# EasyEDA Pro project ProPrj_Practice 4 layer_2025-09-09.epro, schematic Schematic1, sheets 1 to 3 of 5

## Sheets
1 Main: Board Name: Main; Create Date: 2025-08-18; Page Name: Main; Project Name: Practice 4 layer; Schematic Name: Schematic1; Update Date: 2025-09-06; Company: EasyEDA.com; Page Size: A4; Version: V1.0
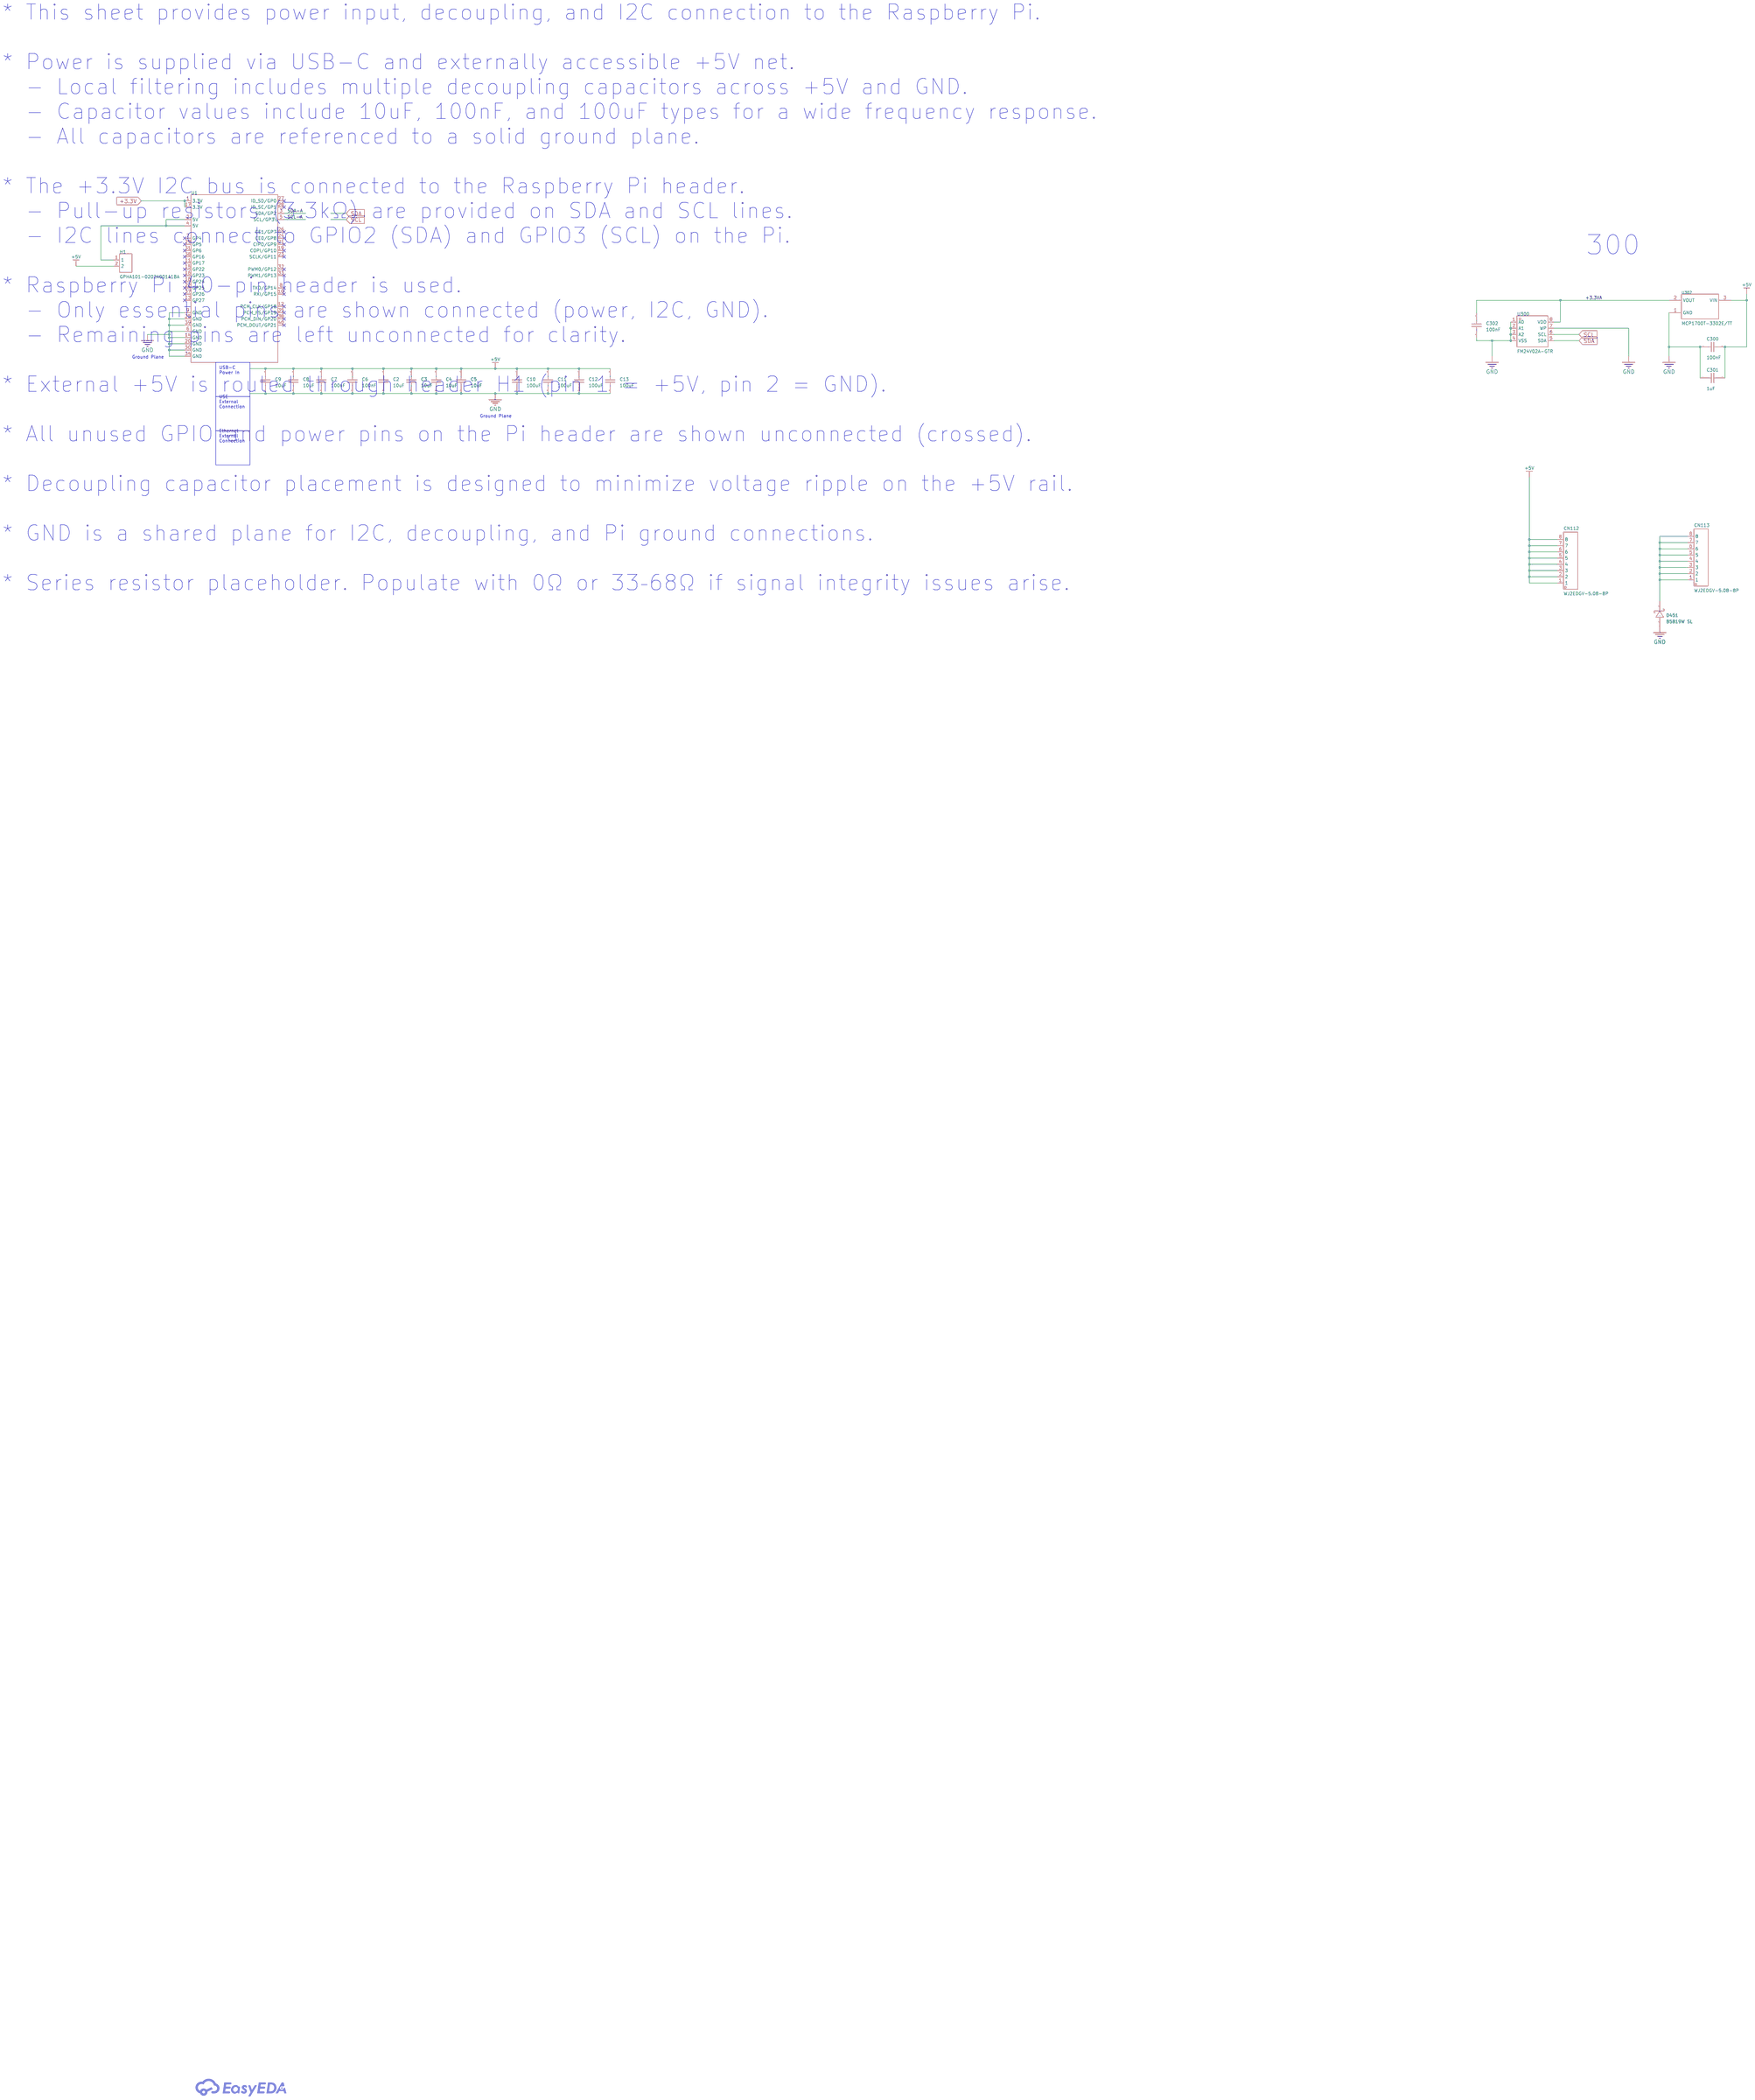
[diagram p10: Main]
2 Analog Out: Create Date: 2025-08-27; Page Name: Analog Out; Update Date: 2025-09-05
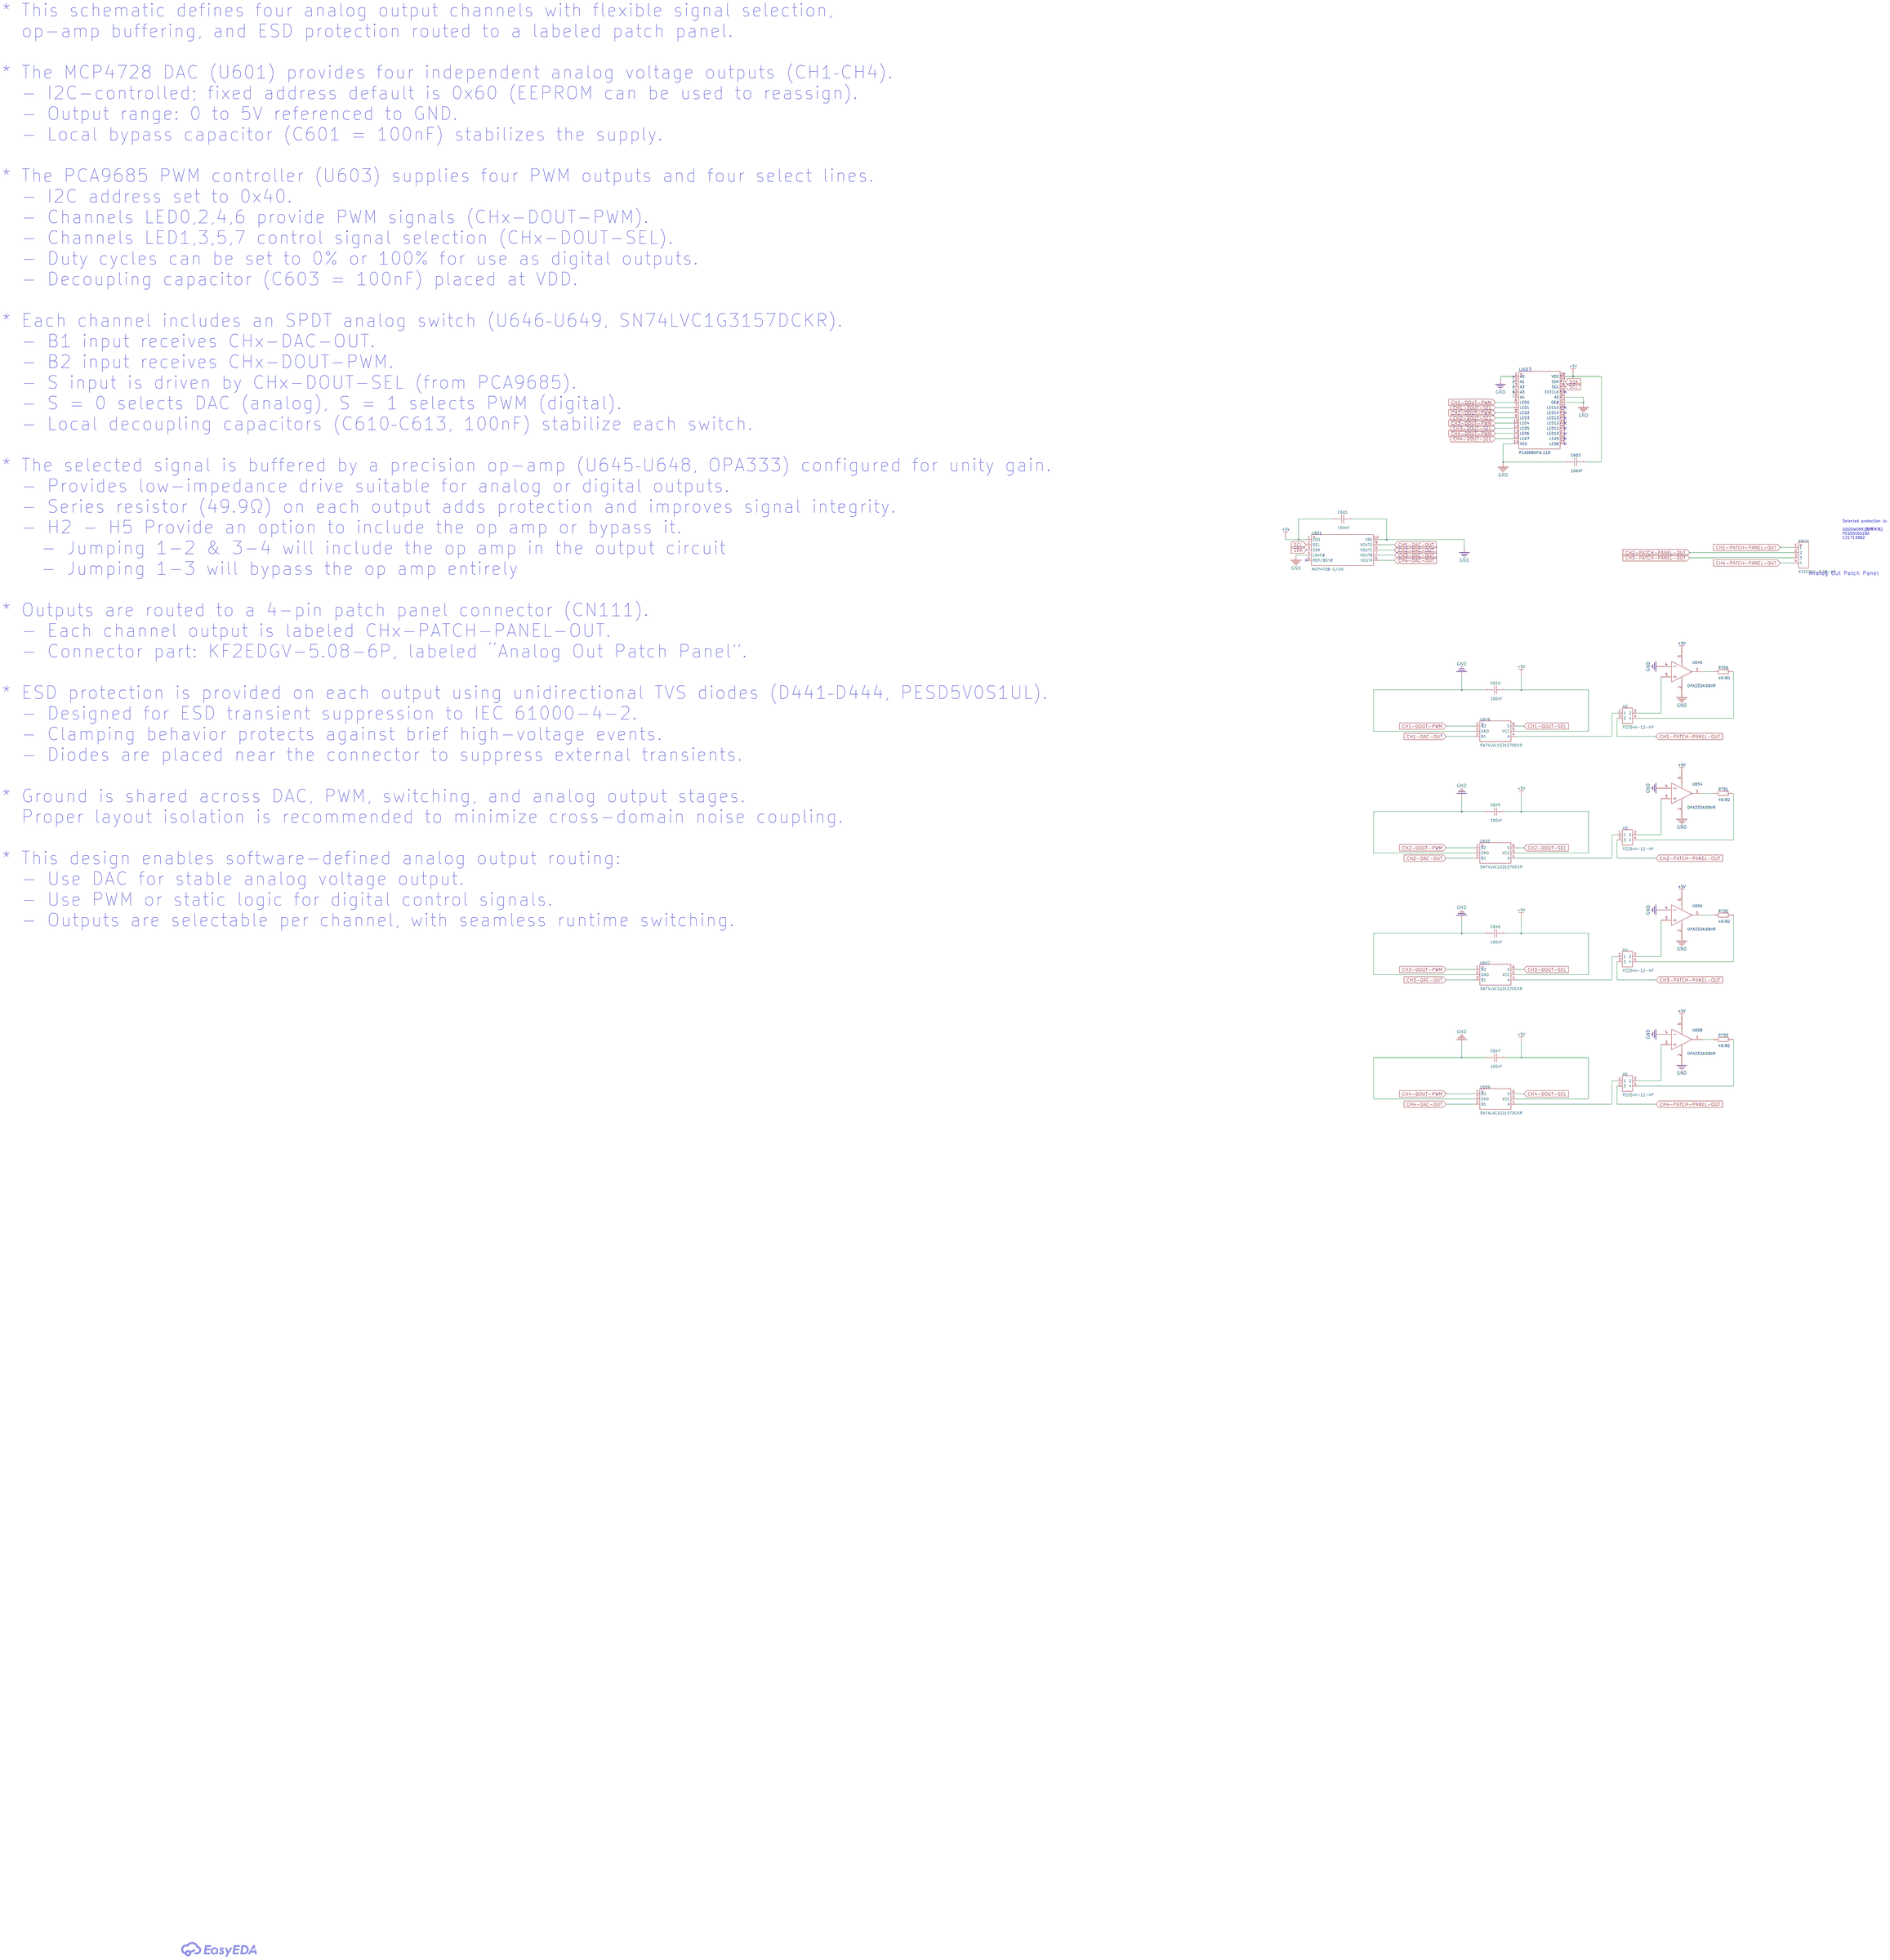
[diagram p11: Analog Out]
3 P4: Create Date: 2025-08-30; Page Name: P4; Update Date: 2025-09-07
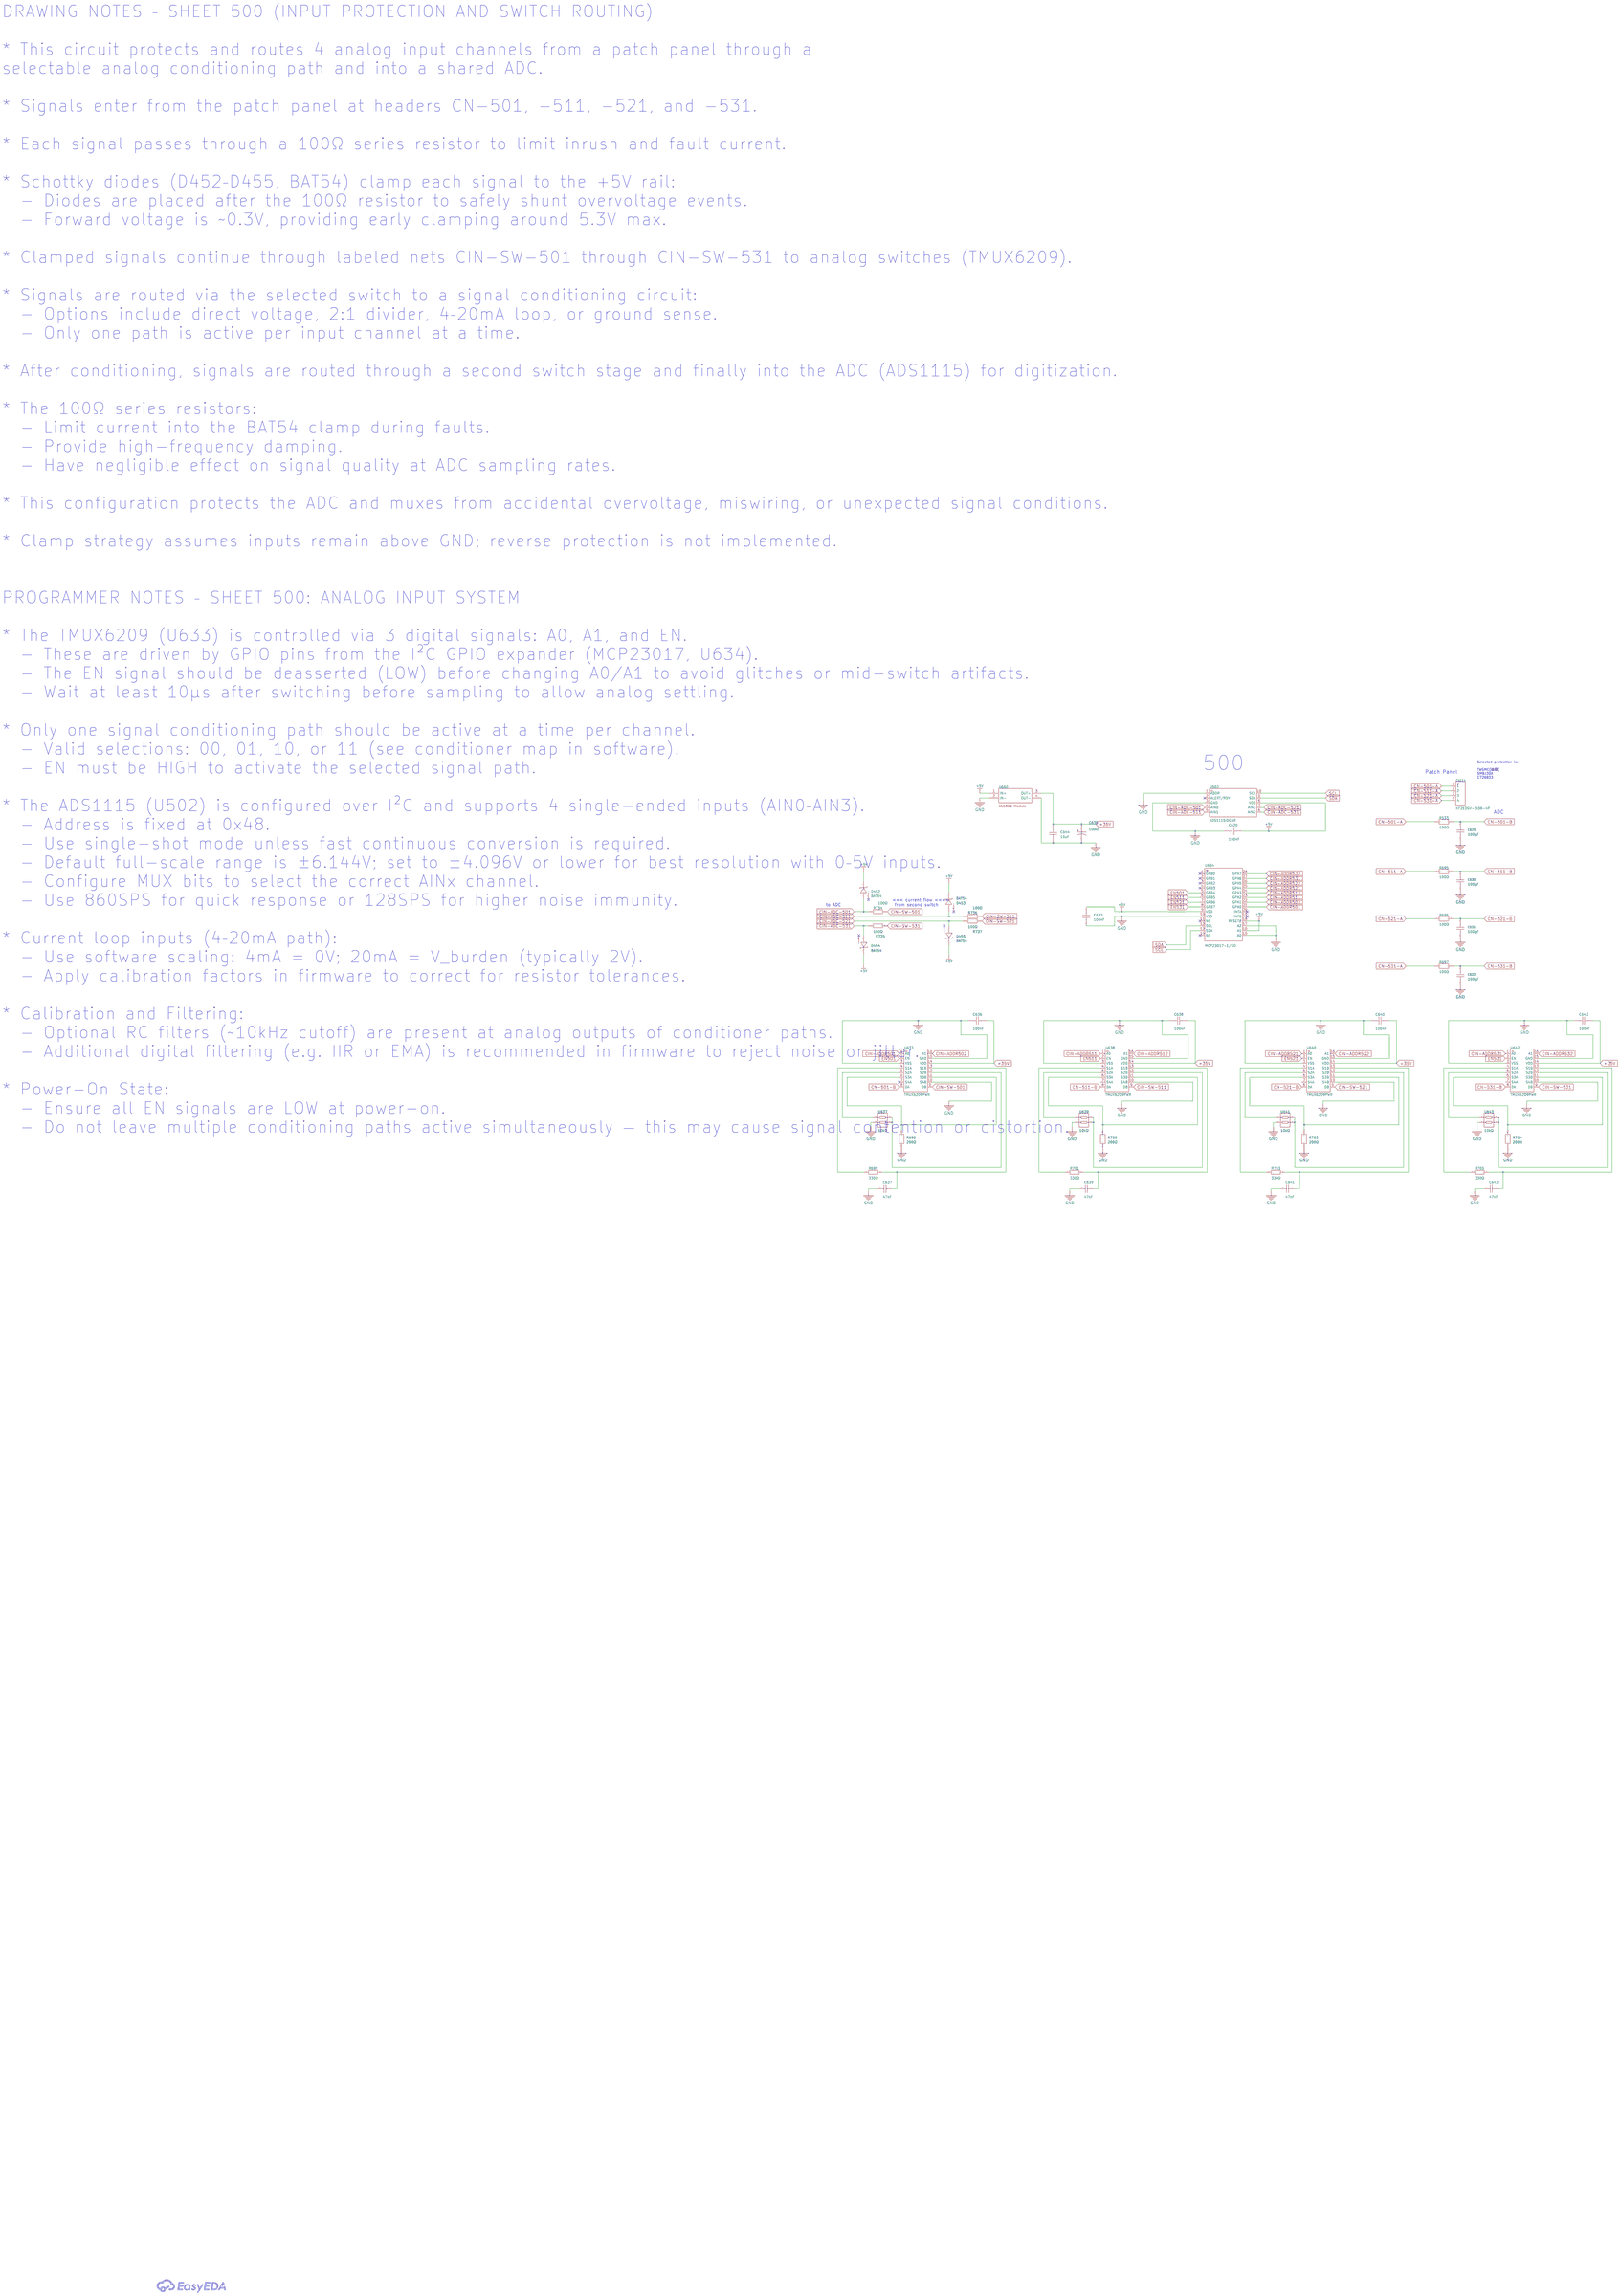
[diagram p12: P4]

## Parts
sheet Analog Out
C601  100nF  [C0603]
C603  100nF  [C0603]
C610  100nF  [C0603]
C645  100nF  [C0603]
C646  100nF  [C0603]
C647  100nF  [C0603]
CN111  KF2EDGV-5.08-4P  [CONN-TH_4P-P5.08_KF2EDGV-5.08-4P]  (no BOM)
H2  PZ254V-12-4P  [HDR-TH_4P-P2.54-V-M-R2-C2-S2.54]  (no BOM)
H3  PZ254V-12-4P  [HDR-TH_4P-P2.54-V-M-R2-C2-S2.54]  (no BOM)
H4  PZ254V-12-4P  [HDR-TH_4P-P2.54-V-M-R2-C2-S2.54]  (no BOM)
H5  PZ254V-12-4P  [HDR-TH_4P-P2.54-V-M-R2-C2-S2.54]  (no BOM)
R706  49.9Ω  [R0603]
R731  49.9Ω  [R0603]
R732  49.9Ω  [R0603]
R733  49.9Ω  [R0603]
U601  MCP4728-E/UN  [MSOP-10_L3.0-W3.0-P0.50-LS5.0-TL]
U603  PCA9685PW,118  [TSSOP-28_L9.7-W4.4-P0.65-LS6.4-TL]
U645  OPA333AIDBVR  [SOT-23-5_L3.0-W1.7-P0.95-LS2.8-BR]
U646  SN74LVC1G3157DCKR  [SC-70-6_L2.2-W1.3-P0.65-LS2.1-BR]
U654  OPA333AIDBVR  [SOT-23-5_L3.0-W1.7-P0.95-LS2.8-BR]
U655  SN74LVC1G3157DCKR  [SC-70-6_L2.2-W1.3-P0.65-LS2.1-BR]
U656  OPA333AIDBVR  [SOT-23-5_L3.0-W1.7-P0.95-LS2.8-BR]
U657  SN74LVC1G3157DCKR  [SC-70-6_L2.2-W1.3-P0.65-LS2.1-BR]
U658  OPA333AIDBVR  [SOT-23-5_L3.0-W1.7-P0.95-LS2.8-BR]
U659  SN74LVC1G3157DCKR  [SC-70-6_L2.2-W1.3-P0.65-LS2.1-BR]
sheet Main
C2  10uF  [C0603]
C3  10uF  [C0603]
C4  10uF  [C0603]
C5  10uF  [C0603]
C6  100nF  [C0603]
C7  100nF  [C0603]
C8  10uF  [C0603]
C9  10uF  [C0603]
C10  100uF  [C0805]
C11  100uF  [C0805]
C12  100uF  [C0805]
C13  100uF  [C0805]
C300  100nF  [C0603]
C301  1uF  [C0603]
C302  100nF  [C0603]
CN112  WJ2EDGV-5.08-8P  [CONN-TH_WJ2EDGV-5.08-8P]  (no BOM)
CN113  WJ2EDGV-5.08-8P  [CONN-TH_WJ2EDGV-5.08-8P]  (no BOM)
D451  B5819W SL  [SOD-123_L2.7-W1.6-LS3.7-RD-1]
H1  GPHA101-0202A001A1BA  [HDR-TH_2P-P2.54-V-M]  (no BOM)
U1  -  [RPI_HEADER_MINIMAL]  (no BOM)
U300  FM24V02A-GTR  [SOIC-8_L5.0-W4.0-P1.27-LS6.0-BL]
U302  MCP1700T-3302E/TT  [SOT-23-3_L2.9-W1.6-P1.90-LS2.8-BR]
sheet P4
C620  100nF  [C0603]
C629  100pF  [C0603]
C630  100pF  [C0603]
C631  100pF  [C0603]
C632  100pF  [C0603]
C633  100nF  [C0603]
C635  100uF  [CAP-SMD_BD6.3-L6.6-W6.6-LS7.2-FD]
C636  100nF  [C0603]
C637  47nF  [C0603]
C638  100nF  [C0603]
C639  47nF  [C0603]
C640  100nF  [C0603]
C641  47nF  [C0603]
C642  100nF  [C0603]
C643  47nF  [C0603]
C644  10uF  [C0805]
CN114  KF2EDGV-5.08-4P  [CONN-TH_4P-P5.08_KF2EDGV-5.08-4P]  (no BOM)
D452  BAT54  [SOT-23-3_L2.9-W1.6-P1.90-LS2.8-BR]
D453  BAT54  [SOT-23-3_L2.9-W1.6-P1.90-LS2.8-BR]
D454  BAT54  [SOT-23-3_L2.9-W1.6-P1.90-LS2.8-BR]
D455  BAT54  [SOT-23-3_L2.9-W1.6-P1.90-LS2.8-BR]
R533  100Ω  [R0603]
R695  100Ω  [R0603]
R696  100Ω  [R0603]
R697  100Ω  [R0603]
R698  200Ω  [R0805]
R699  330Ω  [R0402]
R700  200Ω  [R0805]
R701  330Ω  [R0402]
R702  200Ω  [R0805]
R703  330Ω  [R0402]
R704  200Ω  [R0805]
R705  330Ω  [R0402]
R734  100Ω  [R0603]
R735  100Ω  [R0603]
R736  100Ω  [R0603]
R737  100Ω  [R0603]
U502  ADS1115IDGSR  [MSOP-10_L3.0-W3.0-P0.50-LS5.0-BL]
U633  TMUX6209PWR  [TSSOP-16_L5.0-W4.4-P0.65-LS6.4-BL]
U634  MCP23017-E/SO  [SOIC-28_L18.0-W7.5-P1.27-LS10.3-BL]
U637  10kΩ  [RES-ARRAY-SMD_4P-L1.6-W1.5-BL]
U638  TMUX6209PWR  [TSSOP-16_L5.0-W4.4-P0.65-LS6.4-BL]
U639  10kΩ  [RES-ARRAY-SMD_4P-L1.6-W1.5-BL]
U640  TMUX6209PWR  [TSSOP-16_L5.0-W4.4-P0.65-LS6.4-BL]
U641  10kΩ  [RES-ARRAY-SMD_4P-L1.6-W1.5-BL]
U642  TMUX6209PWR  [TSSOP-16_L5.0-W4.4-P0.65-LS6.4-BL]
U643  10kΩ  [RES-ARRAY-SMD_4P-L1.6-W1.5-BL]
U660  -  [XL6009 Module]  (no BOM)

## Library data of the parts
C300 C302 C601 C603 C610 C620 C633 C636 C638 C640 C642 C645-C647 = CC0603KRX7R9BB104: Capacitance:100nF Tolerance:±10% Tolerance:±10% Voltage Rating:50V Temperature Coefficient:X7R; LCSC Part Name: 100nF ±10% 50V; Supplier Part: C14663; Manufacturer: YAGEO(国巨); Supplier Footprint: 0603; JLCPCB Part Class: Basic Part; Datasheet: https://atta.szlcsc.com/upload/public/pdf/source/20250214/096C4C206003071F5D32E5F0D8E7F8DF.pdf; Supplier: LCSC; Tolerance: ±10%; Voltage Rating: 50V; Temperature Coefficient: X7R
CN111 CN114 = KF2EDGV-5.08-4P: Connector Type:Board Side/Socket - Open Number of Positions or Pins:1x4P Pitch:5.08mm Color:Green Mounting Type:Straight Pin Number of Pins:4P Number of Rows:1 Number of PINs Per Row:4 Current Rating:15A Voltage Rating (Max):300V Operating Temperature:-40; LCSC Part Name: 5.08mm 1x4P 排数:1 每排P数:4; Supplier Part: C441356; Manufacturer: KEFA(科发); Supplier Footprint: 插件,P=5.08mm; JLCPCB Part Class: Extended Part; Datasheet: https://item.szlcsc.com/datasheet/KF2EDGV-5.08-4P/441329.html; Supplier: LCSC; Connector Type: Board Side/Socket - Open; Number of Positions or Pins: 1x4P; Pitch: 5.08mm; Color: Green; Mounting Type: Straight Pin; Number of Pins: 4P; Number of Rows: 1; Number of PINs Per Row: 4; Current Rating: 15A; Voltage Rating (Max): 300V; Operating Temperature: -40℃~+105℃
H2-H5 = PZ254V-12-4P: Pin Structure:2x2P Pitch:2.54mm Row Spacing:2.54mm Circluar Pins/Square Pins:Pin Header Mounting Type:Through Hole Number of Rows:2 Number of Pins:4P Current Rating:- Voltage Rating (Max):- Length of Mating Pin:6mm Insulation Height:2.5mm Length of End Co; LCSC Part Name: 2x2P 间距:2.54mm 方针 直插; Supplier Part: C492419; Manufacturer: XFCN(兴飞); Supplier Footprint: 插件,P=2.54mm; JLCPCB Part Class: Extended Part; Datasheet: https://item.szlcsc.com/datasheet/PZ254V-12-4P/502975.html; Supplier: LCSC; Pin Structure: 2x2P; Pitch: 2.54mm; Row Spacing: 2.54mm; Circluar Pins/Square Pins: Pin Header; Mounting Type: Through Hole; Number of Rows: 2; Number of Pins: 4P; Length of Mating Pin: 6mm; Insulation Height: 2.5mm; Length of End Connection Pin: 3mm; Contact Material: Brass; Operating Temperature: -40℃~+105℃; Color: Black
R706 R731-R733 = 0603WAF499JT5E_C23185: Type:Thick Film Resistor Resistance:49.9Ω Tolerance:±1% Tolerance:±1% Power(Watts):100mW Voltage-Supply(Max):75V Temperature Coefficient:±100ppm/℃ Temperature Coefficient:±100ppm/℃ Operating Temperature:-55℃~+155℃ Operating Temperature:-55℃~+155℃; LCSC Part Name: 49.9Ω ±1% 100mW 厚膜电阻; Supplier Part: C23185; Manufacturer: UNI-ROYAL(厚声); Manufacturer Part: 0603WAF499JT5E; Supplier Footprint: 0603; JLCPCB Part Class: Basic Part; Datasheet: https://item.szlcsc.com/datasheet/0603WAF499JT5E/23912.html; Supplier: LCSC; Type: Thick Film Resistor; Tolerance: ±1%; Power(Watts): 100mW; Voltage-Supply(Max): 75V; Temperature Coefficient: ±100ppm/℃; Operating Temperature: -55℃~+155℃
U601 = MCP4728-E/UN: Resolution(Bits):12Bit Number of Channels:4 Interface:I2C Voltage - Supply:2.7V~5.5V Voltage - Supply:2.7V~5.5V Settling Time:6us Output Type:- INL/DNL(LSB):2LSB INL/DNL(LSB):2LSB Operating Temperature:-40℃~+125℃ Operating Temperature:-40℃~+125℃; LCSC Part Name: F; Supplier Part: C108207; Manufacturer: MICROCHIP(美国微芯); Supplier Footprint: MSOP-10; JLCPCB Part Class: Extended Part; Datasheet: https://atta.szlcsc.com/upload/public/pdf/source/20180207/C108207_15179947749381359004.pdf; Supplier: LCSC; Resolution(Bits): 12Bit; Number of Channels: 4; Interface: I2C; Voltage - Supply: 2.7V~5.5V; Settling Time: 6us; INL/DNL(LSB): 2LSB; Operating Temperature: -40℃~+125℃
U603 = PCA9685PW,118: Type:- Voltage - Input(DC):2.3V~5.5V Voltage - Input(DC):2.3V~5.5V Frequency - Switching:100kHz~1MHz Frequency - Switching:100kHz~1MHz Number of Channels:16 Output Voltage:- Output Voltage:- Output Current:25mA Dimming:PWM Operating temperature:-40℃~+85℃; Supplier Part: C2678753; Manufacturer: NXP(恩智浦); Supplier Footprint: TSSOP-28; JLCPCB Part Class: Extended Part; Datasheet: https://www.nxp.com.cn/docs/en/data-sheet/PCA9685.pdf; Supplier: LCSC; Voltage - Input(DC): 2.3V~5.5V; Frequency - Switching: 100kHz~1MHz; Number of Channels: 16; Output Current: 25mA; Dimming: PWM; Operating temperature: -40℃~+85℃
U645 U654 U656 U658 = OPA333AIDBVR: Number of Channels:1 Gain Bandwidth Product:350kHz Ib - Input Bias Current:70pA Vos - Input Offset Voltage:2uV Common Mode Rejection Ratio(CMRR):130dB Slew Rate:0.16V/us Output Current:5mA Rail to Rail:Rail-to-Rail Input, Rail-to-Rail Output Input Offset; LCSC Part Name: OPAx333 1.8V微功耗CMOS运算放大器零漂移系列; Supplier Part: C30878; Manufacturer: TI(德州仪器); Supplier Footprint: SOT-23-5; JLCPCB Part Class: Extended Part; Datasheet: https://www.ti.com/cn/lit/gpn/opa333; Supplier: LCSC; Number of Channels: 1; Gain Bandwidth Product: 350kHz; Ib - Input Bias Current: 70pA; Vos - Input Offset Voltage: 2uV; Common Mode Rejection Ratio(CMRR): 130dB; Slew Rate: 0.16V/us; Output Current: 5mA; Rail to Rail: Rail-to-Rail Input, Rail-to-Rail Output; Input Offset Voltage Drift(Vos TC): 20nV/℃; Quiescent Current(Iq): 17uA; Operating Temperature: -40℃~+125℃; Single Supply: 1.8V~5.5V; Dual Supply: 900mV~2.75V；-2.75V~-900mV; Maximum Power Supply Range (Vdd-Vss): 5.5V; Input Offset Current(Ios): 140pA
U646 U655 U657 U659 = SN74LVC1G3157DCKR_C38663: Switch Circuit:SPDT(SPDT) Number of Channels:1 Voltage - Supply:1.65V~5.5V Voltage - Supply:1.65V~5.5V Turn-on time:- RDS(on):- Turn-off time:- Operating Temperature:-40℃~+85℃ Operating Temperature:-40℃~+85℃; LCSC Part Name: 单刀双掷模拟开关; Supplier Part: C38663; Manufacturer: TI(德州仪器); Supplier Footprint: SC-70-6(SOT-363); JLCPCB Part Class: Extended Part; Datasheet: https://www.ti.com/cn/lit/gpn/sn74lvc1g3157; Supplier: LCSC; Switch Circuit: SPDT(SPDT); Number of Channels: 1; Voltage - Supply: 1.65V~5.5V; Operating Temperature: -40℃~+85℃
C2-C5 C8 C9 = C0603B106M007T: Capacitance:10uF Tolerance:±20% Tolerance:±20% Voltage Rating:6.3V Temperature Coefficient:X5R; LCSC Part Name: 10uF ±20% 6.3V; Supplier Part: C7094065; Manufacturer: IHHEC(禾伸堂); Supplier Footprint: 0603; JLCPCB Part Class: Extended Part; Datasheet: https://item.szlcsc.com/datasheet/C0603B106M007T/8060709.html; Supplier: LCSC; Tolerance: ±20%; Voltage Rating: 6.3V; Temperature Coefficient: X5R
C6 C7 = 0603X7R104K500NT: Capacitance:100nF Tolerance:±10% Tolerance:±10% Voltage Rating:50V Temperature Coefficient:X7R; LCSC Part Name: 100nF ±10% 50V; Supplier Part: C48579281; Manufacturer: AIDE(爱迪电容); Supplier Footprint: 0603; JLCPCB Part Class: Extended Part; Datasheet: https://atta.szlcsc.com/upload/public/pdf/source/20210330/C2691711_5D01E1D4D7BF54205139C8425089DFE9.pdf; Supplier: LCSC; Tolerance: ±10%; Voltage Rating: 50V; Temperature Coefficient: X7R
C10-C13 = HGC0805R5107M6R3NSLJ: Capacitance:100uF Tolerance:±20% Tolerance:±20% Voltage Rating:6.3V Temperature Coefficient:X5R; LCSC Part Name: 100uF ±20% 6.3V; Supplier Part: C49333236; Manufacturer: Chinocera(华瓷); Supplier Footprint: 0805; JLCPCB Part Class: Extended Part; Datasheet: https://item.szlcsc.com/datasheet/HGC0805R5107M6R3NSLJ/51817927.html; Supplier: LCSC; Tolerance: ±20%; Voltage Rating: 6.3V; Temperature Coefficient: X5R
C301 = CL10A105KB8NNNC: Capacitance:1uF Tolerance:±10% Tolerance:±10% Voltage Rating:50V Temperature Coefficient:X5R; LCSC Part Name: 1uF ±10% 50V; Supplier Part: C15849; Manufacturer: SAMSUNG(三星); Supplier Footprint: 0603; JLCPCB Part Class: Basic Part; Datasheet: https://item.szlcsc.com/datasheet/CL10A105KB8NNNC/16531.html; Supplier: LCSC; Tolerance: ±10%; Voltage Rating: 50V; Temperature Coefficient: X5R
CN112 CN113 = WJ2EDGV-5.08-8P: Connector Type:Board Side/Socket - Open Termination Style:- Number of Positions or Pins:1x8P Pitch:5.08mm Color:Green Mounting Type:Straight Pin Number of Pins:8P Number of Rows:1 Number of PINs Per Row:8 Current Rating:20A Voltage Rating (Max):450V Wire; LCSC Part Name: 1x8P 5.08mm 排数:1 每排P数:8; Supplier Part: C23595; Manufacturer: KANGNEX(康奈克斯电气); Supplier Footprint: 插件,P=5.08mm; JLCPCB Part Class: Extended Part; Datasheet: https://item.szlcsc.com/datasheet/WJ2EDGV-5.08-8P/24331.html; Supplier: LCSC; Connector Type: Board Side/Socket - Open; Number of Positions or Pins: 1x8P; Pitch: 5.08mm; Color: Green; Mounting Type: Straight Pin; Number of Pins: 8P; Number of Rows: 1; Number of PINs Per Row: 8; Current Rating: 20A; Voltage Rating (Max): 450V; Operating Temperature: -40℃~+105℃
D451 = B5819W SL: Voltage - Forward(Vf@If):600mV@1A Voltage - DC Reverse(Vr):40V Current - Rectified:1A Non-Repetitive Peak Forward Surge Current:9A; LCSC Part Name: 电压:40V 电流:1A; Supplier Part: C8598; Manufacturer: CJ(江苏长电/长晶); Supplier Footprint: SOD-123; JLCPCB Part Class: Basic Part; Datasheet: https://item.szlcsc.com/datasheet/B5819W%2520SL/9093.html; Supplier: LCSC; Voltage - Forward(Vf@If): 600mV@1A; Voltage - DC Reverse(Vr): 40V; Current - Rectified: 1A; Non-Repetitive Peak Forward Surge Current: 9A
H1 = GPHA101-0202A001A1BA: Pin Structure:1x2P Pitch:2.54mm Row Spacing:2.54mm Circluar Pins/Square Pins:Pin Header Mounting Type:Through Hole Number of Rows:1 Number of Pins:2P Current Rating:3A Operating Temperature:-40℃~+105℃ Operating Temperature:-40℃~+105℃; LCSC Part Name: 1x2P 间距:2.54mm 方针 直插; Supplier Part: C7434479; Manufacturer: GREENCONN(格康); Supplier Footprint: 插件,P=2.54mm; JLCPCB Part Class: Extended Part; Datasheet: https://item.szlcsc.com/datasheet/GPHA101-0202A001A1BA/8446403.html; Supplier: LCSC; Pin Structure: 1x2P; Pitch: 2.54mm; Row Spacing: 2.54mm; Circluar Pins/Square Pins: Pin Header; Mounting Type: Through Hole; Number of Rows: 1; Number of Pins: 2P; Current Rating: 3A; Operating Temperature: -40℃~+105℃
U1 = RASPBERRYPI-40-PIN-GPIO_PTH_REF
U300 = FM24V02A-GTR_C382041: Interface:I2C Memory Size:256Kbit Voltage - Supply:2V~3.6V Voltage - Supply:2V~3.6V Current - Supply:175uA Clock Frequency:3.4MHz Standby Current(Isb):90uA Sleep mode current (Izz):5uA Operating Temperature:-40℃~+85℃ Operating Temperature:-40℃~+85℃; LCSC Part Name: 通信接口:I2C 256Kbit 3V; Supplier Part: C382041; Manufacturer: Infineon/CYPRESS(赛普拉斯); Supplier Footprint: SOIC-8; JLCPCB Part Class: Extended Part; Datasheet: https://atta.szlcsc.com/upload/public/pdf/source/20190614/C382041_C3F94E576F7C40B566ED6AEEBCDEDB14.pdf; Supplier: LCSC; Interface: I2C; Memory Size: 256Kbit; Voltage - Supply: 2V~3.6V; Current - Supply: 175uA; Clock Frequency: 3.4MHz; Standby Current(Isb): 90uA; Sleep mode current (Izz): 5uA; Operating Temperature: -40℃~+85℃
U302 = MCP1700T-3302E/TT: Output Type:Fixed Voltage - Supply:6V Output Voltage:3.3V Output Voltage:3.3V Output Current:250mA Power Supply Rejection Ratio (PSRR):44dB@(100Hz) Voltage Dropout:178mV@(250mA) standby current:1.6uA Features:Short Circuit Protection；Over Temperature Prot; LCSC Part Name: 输入6V 输出3.3V 250mA; Supplier Part: C39051; Manufacturer: MICROCHIP(美国微芯); Supplier Footprint: SOT-23; JLCPCB Part Class: Extended Part; Datasheet: https://item.szlcsc.com/datasheet/MCP1700T-3302E%252FTT/40034.html; Supplier: LCSC; Output Type: Fixed; Voltage - Supply: 6V; Output Voltage: 3.3V; Output Current: 250mA; Power Supply Rejection Ratio (PSRR): 44dB@(100Hz); Voltage Dropout: 178mV@(250mA); standby current: 1.6uA; Features: Short Circuit Protection；Over Temperature Protection; Operating Temperature: -40℃~+125℃@(Tj); Output Configuration: Positive; Number of Outputs: 1
C629-C632 = TCC0603COG101J500CT: Capacitance:100pF Tolerance:±5% Tolerance:±5% Voltage Rating:50V Temperature Coefficient:C0G; LCSC Part Name: 100pF ±5% 50V; Supplier Part: C344186; Manufacturer: CCTC(三环); Supplier Footprint: 0603; JLCPCB Part Class: Extended Part; Datasheet: https://item.szlcsc.com/datasheet/TCC0603COG101J500CT/322738.html; Supplier: LCSC; Tolerance: ±5%; Voltage Rating: 50V; Temperature Coefficient: C0G
C635 = MVK 35V100 M 6.3*8: Capacitance:100uF Tolerance:±20% Tolerance:±20% Voltage Rating:35V Ripple Current:52mA@120Hz Equivalent Series Resistance(ESR):- Diameter:6.3mm Height - Seated (Max):8mm Lifetime:1000hrs@105℃ Operating Temperature:-40℃~+105℃ Operating Temperature:-40℃~+10; LCSC Part Name: 100uF ±20% 35V; Supplier Part: C350012; Manufacturer: SAMYOUNG(韩国三莹); Supplier Footprint: SMD,D6.3xL8mm; JLCPCB Part Class: Extended Part; Datasheet: https://item.szlcsc.com/datasheet/MVK%252035V100%2520M%25206.3*8/326275.html; Supplier: LCSC; Tolerance: ±20%; Voltage Rating: 35V; Ripple Current: 52mA@120Hz; Diameter: 6.3mm; Height - Seated (Max): 8mm; Lifetime: 1000hrs@105℃; Operating Temperature: -40℃~+105℃
C637 C639 C641 C643 = CL10B473KB8NNNC: Capacitance: Tolerance:±10% Tolerance:±10% Voltage Rated: Temperature Coefficient:; LCSC Part Name: 47nF ±10% 50V; Supplier Part: C1622; Manufacturer: SAMSUNG(三星); Supplier Footprint: 0603; JLCPCB Part Class: Basic Part; Datasheet: https://atta.szlcsc.com/upload/public/pdf/source/20160218/1457707763339.pdf; Supplier: LCSC; Tolerance: ±10%
C644 = CGA0805X5R106K350MT: Capacitance:10uF Tolerance:±10% Tolerance:±10% Voltage Rating:35V Temperature Coefficient:X5R; LCSC Part Name: 10uF ±10% 35V; Supplier Part: C6119888; Manufacturer: HRE(芯声); Supplier Footprint: 0805; JLCPCB Part Class: Extended Part; Datasheet: https://atta.szlcsc.com/upload/public/pdf/source/20250103/7EE7776C5D039D8AF646A3DBD9E7F50D.pdf; Supplier: LCSC; Tolerance: ±10%; Voltage Rating: 35V; Temperature Coefficient: X5R
D452-D455 = BAT54_C47283675: Voltage - Forward(Vf@If):1V@100mA Voltage - DC Reverse(Vr):30V Reverse Leakage Current (Ir):2uA@25V; Supplier Part: C47283675; Manufacturer: TWGMC(迪嘉); Supplier Footprint: SOT-23; JLCPCB Part Class: Extended Part; Datasheet: https://item.szlcsc.com/datasheet/BAT54/49490714.html; Supplier: LCSC; Voltage - Forward(Vf@If): 1V@100mA; Voltage - DC Reverse(Vr): 30V; Reverse Leakage Current (Ir): 2uA@25V
R533 R695-R697 = SCR0603J100R: Type:Thick Film Resistors Resistance: Tolerance:±5% Tolerance:±5% Power(Watts): Overload Voltage (Max): Operating Temperature Range:-55℃~+155℃ Operating Temperature Range:-55℃~+155℃; LCSC Part Name: 厚膜电阻 100Ω ±5% 100mW; Supplier Part: C3017758; Manufacturer: VO(翔胜); Supplier Footprint: 0603; JLCPCB Part Class: Extended Part; Datasheet: https://atta.szlcsc.com/upload/public/pdf/source/20220513/247AF9639BA21CF93567DC289CCC6A22.pdf; Supplier: LCSC; Type: Thick Film Resistors; Tolerance: ±5%; Operating Temperature Range: -55℃~+155℃
R698 R700 R702 R704 = FRC0805J201 TS: Type:Thick Film Resistor Resistance:200Ω Tolerance:±5% Tolerance:±5% Power(Watts):125mW Voltage-Supply(Max):150V Temperature Coefficient:±100ppm/℃ Temperature Coefficient:±100ppm/℃ Operating Temperature:-55℃~+155℃ Operating Temperature:-55℃~+155℃; LCSC Part Name: 200Ω ±5% 125mW 厚膜电阻; Supplier Part: C2933534; Manufacturer: FOJAN(富捷); Supplier Footprint: 0805; JLCPCB Part Class: Extended Part; Datasheet: https://item.szlcsc.com/datasheet/FRC0805J201%2520TS/3279636.html; Supplier: LCSC; Type: Thick Film Resistor; Tolerance: ±5%; Power(Watts): 125mW; Voltage-Supply(Max): 150V; Temperature Coefficient: ±100ppm/℃; Operating Temperature: -55℃~+155℃
R699 R701 R703 R705 = RC0402FR-07330RL: Type:Thick Film Resistor Resistance:330Ω Tolerance:±1% Tolerance:±1% Power(Watts):62.5mW Voltage-Supply(Max):50V Temperature Coefficient:±100ppm/℃ Temperature Coefficient:±100ppm/℃ Operating Temperature:-55℃~+155℃ Operating Temperature:-55℃~+155℃; LCSC Part Name: 厚膜电阻 330Ω ±1% 62.5mW; Supplier Part: C105875; Manufacturer: YAGEO(国巨); Supplier Footprint: 0402; JLCPCB Part Class: Extended Part; Datasheet: https://item.szlcsc.com/datasheet/RC0402FR-07330RL/107090.html; Supplier: LCSC; Type: Thick Film Resistor; Tolerance: ±1%; Power(Watts): 62.5mW; Voltage-Supply(Max): 50V; Temperature Coefficient: ±100ppm/℃; Operating Temperature: -55℃~+155℃
R734-R737 = 0603WAF1000T5E: Type:Thick Film Resistors Resistance: Tolerance:±1% Tolerance:±1% Power(Watts): Overload Voltage (Max): Temperature Coefficient:±200ppm/℃ Temperature Coefficient:±200ppm/℃ Operating Temperature Range:-55℃~+155℃ Operating Temperature Range:-55℃~+155℃; LCSC Part Name: 100Ω ±1% 100mW 厚膜电阻; Supplier Part: C22775; Manufacturer: UNI-ROYAL(厚声); Supplier Footprint: 0603; JLCPCB Part Class: Basic Part; Datasheet: https://atta.szlcsc.com/upload/public/pdf/source/20200306/C422600_1E6D84923E4A46A82E41ADD87F860B5C.pdf; Supplier: LCSC; Type: Thick Film Resistors; Tolerance: ±1%; Temperature Coefficient: ±200ppm/℃; Operating Temperature Range: -55℃~+155℃
U502 = ADS1115IDGSR: Resolution(Bits):16Bit Sampling Rate:- number of channels:4 Voltage - Supply:2V~5.5V Voltage - Supply:2V~5.5V Interface:I2C differential input:- Integral non - linearity:1LSB Integral non - linearity:1LSB Operating Temperature:-40℃~+125℃ Operating Tempera; LCSC Part Name: 具有内部基准、振荡器和可编程比较器且兼容 I2C 的ADS111x、超小型、低功耗 860SPS、16位ADC; Supplier Part: C37593; Manufacturer: TI(德州仪器); Supplier Footprint: VSSOP-10; JLCPCB Part Class: Extended Part; Datasheet: https://www.ti.com/cn/lit/gpn/ads1115; Supplier: LCSC; Resolution(Bits): 16Bit; number of channels: 4; Voltage - Supply: 2V~5.5V; Interface: I2C; Integral non - linearity: 1LSB; Operating Temperature: -40℃~+125℃
U633 U638 U640 U642 = TMUX6209PWR: Switch Circuit:Four Pole Single Throw (4PST) - Normally Open Number of Channels:2 Supply Voltage:4.5V~36V Supply Voltage:4.5V~36V Turn-on time:200ns On-State Resistance (Max):6.2Ω Turn-off time:290ns; LCSC Part Name: 具有1.8V逻辑电平的TMUX620x36V、低Ron、8:1单通道和4:1双通道精密多路复用器; Supplier Part: C3658008; Manufacturer: TI(德州仪器); Supplier Footprint: TSSOP-16; JLCPCB Part Class: Extended Part; Datasheet: https://www.ti.com/cn/lit/gpn/tmux6208; Supplier: LCSC; Switch Circuit: Four Pole Single Throw (4PST) - Normally Open; Number of Channels: 2; Supply Voltage: 4.5V~36V; Turn-on time: 200ns; On-State Resistance (Max): 6.2Ω; Turn-off time: 290ns
U634 = MCP23017-E/SO: Interface:- Number of I/O:16 Interrupt Output:With Interrupt Output Output Type:- Voltage - Supply:1.8V~5.5V Voltage - Supply:1.8V~5.5V Current - Output Low(IOL):- Current - Output High(IOH):- Clock Frequency:1.7MHz Operating Temperature:-40℃~+85℃ Operati; LCSC Part Name: 16位I/O扩展器带串行接口; Supplier Part: C47023; Manufacturer: MICROCHIP(美国微芯); Supplier Footprint: SOIC-28-300mil; JLCPCB Part Class: Extended Part; Datasheet: https://atta.szlcsc.com/upload/public/pdf/source/20221209/1BF939F88C2D907BC056D7BF485E3103.pdf; Supplier: LCSC; Number of I/O: 16; Interrupt Output: With Interrupt Output; Voltage - Supply: 1.8V~5.5V; Clock Frequency: 1.7MHz; Operating Temperature: -40℃~+85℃
U637 U639 U641 U643 = ACASN1002S1002P1AT: Number of Resistors: Resistance: Tolerance:±0.1% Tolerance:±0.1% Power(Watts): Temperature Coefficient:±25ppm/℃ Temperature Coefficient:±25ppm/℃ Number of Pins:; LCSC Part Name: 10kΩ ±0.1%; Supplier Part: C2654064; Manufacturer: VISHAY(威世); Supplier Footprint: 0603x2; JLCPCB Part Class: Extended Part; Datasheet: https://atta.szlcsc.com/upload/public/pdf/source/20210610/946032B312301F04FF34E4BF4252574C.pdf; Supplier: LCSC; Tolerance: ±0.1%; Temperature Coefficient: ±25ppm/℃
U660 = XL6009 Module

## Nets
+3.3V: U1.1(3.3V) U1.17(3.3V)
+3.3VA: C302.2 U300.8(VDD) U302.2(VOUT)
+5V: C2.2 C3.2 C4.2 C5.2 C6.2 C7.2 C8.2 C9.2 C10.2 C11.2 C12.2 C13.2 C300.2 C301.2 C601.1 C603.2 C610.1 C620.2 C633.1 C645.1 C646.1 C647.1 CN112.1 CN112.2 CN112.3 CN112.4 CN112.5 CN112.6 CN112.7 CN112.8 D452.3(K) D453.3(K) D454.3(K) D455.3(K) H1.2 U302.3(VIN) U502.8(VDD) U601.1(VDD) U603.28(VDD) U634.9(VDD) U634.16(A1) U634.18(RESET#) U645.5(V+) U646.5(VCC) U654.5(V+) U655.5(VCC) U656.5(V+) U657.5(VCC) U658.5(V+) U659.5(VCC) U660.1(IN+) ; also on sheet 4 5
+35V: C635.1 C636.2 C638.2 C640.2 C642.2 C644.2 U633.14(VDD) U638.14(VDD) U640.14(VDD) U642.14(VDD) U660.3(OUT+)
GND: C2.1 C3.1 C4.1 C5.1 C6.1 C7.1 C8.1 C9.1 C10.1 C11.1 C12.1 C13.1 C300.1 C301.1 C302.1 C601.2 C603.1 C610.2 C620.1 C629.1 C630.1 C631.1 C632.1 C633.2 C635.2 C636.1 C637.2 C638.1 C639.2 C640.1 C641.2 C642.1 C643.2 C644.1 C645.2 C646.2 C647.2 D451.2(+) R698.1 R700.1 R702.1 R704.1 U1.6(GND) U1.9(GND) U1.14(GND) U1.20(GND) U1.25(GND) U1.30(GND) U1.34(GND) U1.39(GND) U300.1(A0) U300.2(A1) U300.3(A2) U300.4(VSS) U300.7(WP) U302.1(GND) U502.1(ADDR) U502.3(GND) U601.4(LDAC#) U601.10(VSS) U603.1(A0) U603.2(A1) U603.3(A2) U603.4(A3) U603.5(A4) U603.14(VSS) U603.23(OE#) U603.24(A5) U633.3(VSS) U633.10(S4B) U633.15(GND) U634.10(VSS) U634.15(A0) U634.17(A2) U637.3 U638.3(VSS) U638.10(S4B) U638.15(GND) U639.3 U640.3(VSS) U640.10(S4B) U640.15(GND) U641.3 U642.3(VSS) U642.10(S4B) U642.15(GND) U643.3 U645.2(V-) U645.4(IN-) U646.2(GND) U654.2(V-) U654.4(IN-) U655.2(GND) U656.2(V-) U656.4(IN-) U657.2(GND) U658.2(V-) U658.4(IN-) U659.2(GND) U660.2(IN-) U660.4(OUT-) ; also on sheet 4 5
CH1-DAC-OUT: U601.9(VOUTD) U646.3(B1)
CH1-DOUT-PWM: U603.6(LED0) U646.1(B2)
CH1-DOUT-SEL: U603.7(LED1) U646.6(S)
CH1-PATCH-PANEL-OUT: CN111.1 H2.3
CH2-DAC-OUT: U601.8(VOUTC) U655.3(B1)
CH2-DOUT-PWM: U603.8(LED2) U655.1(B2)
CH2-DOUT-SEL: U603.9(LED3) U655.6(S)
CH2-PATCH-PANEL-OUT: CN111.2 H3.3
CH3-DAC-OUT: U601.7(VOUTB) U657.3(B1)
CH3-DOUT-PWM: U603.10(LED4) U657.1(B2)
CH3-DOUT-SEL: U603.11(LED5) U657.6(S)
CH3-PATCH-PANEL-OUT: CN111.3 H4.3
CH4-DAC-OUT: U601.6(VOUTA) U659.3(B1)
CH4-DOUT-PWM: U603.12(LED6) U659.1(B2)
CH4-DOUT-SEL: U603.13(LED7) U659.6(S)
CH4-PATCH-PANEL-OUT: CN111.4 H5.3
CIN-ADC-501: D452.1(A) R734.2 U502.4(AIN0)
CIN-ADC-511: D453.1(A) R736.1 U502.5(AIN1)
CIN-ADC-521: D455.1(A) R737.1 U502.7(AIN3)
CIN-ADC-531: D454.1(A) R735.2 U502.6(AIN2)
CIN-ADDR501: U633.1(A0) U634.21(GPA0)
CIN-ADDR502: U633.16(A1) U634.22(GPA1)
CIN-ADDR511: U634.23(GPA2) U638.1(A0)
CIN-ADDR512: U634.24(GPA3) U638.16(A1)
CIN-ADDR521: U634.25(GPA4) U640.1(A0)
CIN-ADDR522: U634.26(GPA5) U640.16(A1)
CIN-ADDR531: U634.27(GPA6) U642.1(A0)
CIN-ADDR532: U634.28(GPA7) U642.16(A1)
CIN-SW-501: R734.1 U633.9(DB)
CIN-SW-511: R736.2 U638.9(DB)
CIN-SW-521: R737.2 U640.9(DB)
CIN-SW-531: R735.1 U642.9(DB)
CN-501-A: CN114.1 R533.1
CN-501-B: C629.2 R533.2 U633.8(DA)
CN-511-A: CN114.2 R695.1
CN-511-B: C630.2 R695.2 U638.8(DA)
CN-521-A: CN114.3 R696.1
CN-521-B: C631.2 R696.2 U640.8(DA)
CN-531-A: CN114.4 R697.1
CN-531-B: C632.2 R697.2 U642.8(DA)
EN501: U633.2(EN) U634.5(GPB4)
EN511: U634.6(GPB5) U638.2(EN)
EN521: U634.7(GPB6) U640.2(EN)
EN531: U634.8(GPB7) U642.2(EN)
SCL: U300.6(SCL) U502.10(SCL) U601.2(SCL) U603.26(SCL) U634.13(SDA) ; also on sheet 4 5
SCL-A: U1.5(SCL/GP3\)
SDA: U300.5(SDA) U502.9(SDA) U601.3(SDA) U603.27(SDA) U634.12(SCL) ; also on sheet 4 5
SDA-A: U1.3(SDA/GP2)
$1N21727: CN113.1 CN113.2 CN113.3 CN113.4 CN113.5 CN113.6 CN113.7 CN113.8 D451.1(-)
$1N22026: H1.1 U1.2(5V) U1.4(5V)
$3N10869: R706.1 U645.1(OUT)
$3N13479: H2.2 U645.3(IN+)
$3N13628: H2.4 R706.2
$3N13646: H2.1 U646.4(A)
$3N14146: R731.1 U654.1(OUT)
$3N14151: H3.2 U654.3(IN+)
$3N14154: H3.4 R731.2
$3N14160: H3.1 U655.4(A)
$3N14504: R732.1 U656.1(OUT)
$3N14509: H4.2 U656.3(IN+)
$3N14512: H4.4 R732.2
$3N14518: H4.1 U657.4(A)
$3N14862: R733.1 U658.1(OUT)
$3N14867: H5.2 U658.3(IN+)
$3N14870: H5.4 R733.2
$3N14876: H5.1 U659.4(A)
$4N20913: U633.12(S2B) U637.2 U637.4
$4N20918: U633.5(S2A) U637.1
$4N21167: R698.2 U633.6(S3A) U633.11(S3B)
$4N21350: C637.1 R699.1 U633.13(S1B)
$4N21354: R699.2 U633.4(S1A)
$4N21829: U638.12(S2B) U639.2 U639.4
$4N21835: U638.5(S2A) U639.1
$4N21841: R700.2 U638.6(S3A) U638.11(S3B)
$4N21869: C639.1 R701.1 U638.13(S1B)
$4N21876: R701.2 U638.4(S1A)
$4N22288: U640.12(S2B) U641.2 U641.4
$4N22294: U640.5(S2A) U641.1
$4N22300: R702.2 U640.6(S3A) U640.11(S3B)
$4N22328: C641.1 R703.1 U640.13(S1B)
$4N22335: R703.2 U640.4(S1A)
$4N22747: U642.12(S2B) U643.2 U643.4
$4N22753: U642.5(S2A) U643.1
$4N22759: R704.2 U642.6(S3A) U642.11(S3B)
$4N22787: C643.1 R705.1 U642.13(S1B)
$4N22794: R705.2 U642.4(S1A)

Not connected (* = marked no-connect by the designer): D452 2(NC)*; D453 2(NC)*; D454 2(NC)*; D455 2(NC)*; U1 7(GP4)* 8(TXO/GP14)* 10(RXI/GP15)* 11(GP17)* 12(PCM_CLK/GP18)* 13(GP27)* 15(GP22)* 16(GP23)* 18(GP24)* 19(COPI/GP10)* 21(CIPO/GP9)* 22(GP25)* 23(SCLK/GP11)* 24(CE0/GP8)* 26(CE1/GP7)* 27(ID_SD/GP0)* 28(ID_SC/GP1)* 29(GP5)* 31(GP6)* 32(PWM0/GP12)* 33(PWM1/GP13)* 35(PCM_FS/GP19)* 36(GP16)* 37(GP26)* 38(PCM_DIN/GP20)* 40(PCM_DOUT/GP21)*; U502 2(ALERT/RDY)*; U601 5(RDY/BSY#)*; U603 15(LED8)* 16(LED9)* 17(LED10)* 18(LED11)* 19(LED12)* 20(LED13)* 21(LED14)* 22(LED15)* 25(EXTCLK)*; U633 7(S4A)*; U634 1(GPB0)* 2(GPB1)* 3(GPB2)* 4(GPB3)* 11(NC)* 14(NC)* 19(INTB)* 20(INTA)*; U638 7(S4A); U640 7(S4A); U642 7(S4A)

## Notes on the sheets
sheet 1
- 300
- Ground Plane
- USB-C
  Power In
- USE
  External
  Connection
- Ground Plane
- Ethernet
  External
  Connection
- * This sheet provides power input, decoupling, and I2C connection to the Raspberry Pi.
  * Power is supplied via USB-C and externally accessible +5V net.
    - Local filtering includes multiple decoupling capacitors across +5V and GND.
    - Capacitor values include 10uF, 100nF, and 100uF types for a wide frequency response.
    - All capacitors are referenced to a solid ground plane.
  * The +3.3V I2C bus is connected to the Raspberry Pi header.
    - Pull-up resistors (3.3kΩ) are provided on SDA and SCL lines.
    - I2C lines connect to GPIO2 (SDA) and GPIO3 (SCL) on the Pi.
  * Raspberry Pi 40-pin header is used.
    - Only essential pins are shown connected (power, I2C, GND).
    - Remaining pins are left unconnected for clarity.
  * External +5V is routed through header H1 (pin 1 = +5V, pin 2 = GND).
  * All unused GPIO and power pins on the Pi header are shown unconnected (crossed).
  * Decoupling capacitor placement is designed to minimize voltage ripple on the +5V rail.
  * GND is a shared plane for I2C, decoupling, and Pi ground connections.
  * Series resistor placeholder. Populate with 0Ω or 33–68Ω if signal integrity issues arise.
sheet 2
- Selected protection is:
  GOODWORK(固得沃克)
  PESD5V0S1BA
  C21713982
- Analog Out Patch Panel
- * This schematic defines four analog output channels with flexible signal selection,
    op-amp buffering, and ESD protection routed to a labeled patch panel.
  * The MCP4728 DAC (U601) provides four independent analog voltage outputs (CH1–CH4).
    - I2C-controlled; fixed address default is 0x60 (EEPROM can be used to reassign).
    - Output range: 0 to 5V referenced to GND.
    - Local bypass capacitor (C601 = 100nF) stabilizes the supply.
  * The PCA9685 PWM controller (U603) supplies four PWM outputs and four select lines.
    - I2C address set to 0x40.
    - Channels LED0,2,4,6 provide PWM signals (CHx-DOUT-PWM).
    - Channels LED1,3,5,7 control signal selection (CHx-DOUT-SEL).
    - Duty cycles can be set to 0% or 100% for use as digital outputs.
    - Decoupling capacitor (C603 = 100nF) placed at VDD.
  * Each channel includes an SPDT analog switch (U646–U649, SN74LVC1G3157DCKR).
    - B1 input receives CHx-DAC-OUT.
    - B2 input receives CHx-DOUT-PWM.
    - S input is driven by CHx-DOUT-SEL (from PCA9685).
    - S = 0 selects DAC (analog), S = 1 selects PWM (digital).
    - Local decoupling capacitors (C610–C613, 100nF) stabilize each switch.
  * The selected signal is buffered by a precision op-amp (U645–U648, OPA333) configured for unity gain.
    - Provides low-impedance drive suitable for analog or digital outputs.
    - Series resistor (49.9Ω) on each output adds protection and improves signal integrity.
    - H2 - H5 Provide an option to include the op amp or bypass it.
      - Jumping 1-2 & 3-4 will include the op amp in the output circuit
      - Jumping 1-3 will bypass the op amp entirely
  * Outputs are routed to a 4-pin patch panel connector (CN111).
    - Each channel output is labeled CHx-PATCH-PANEL-OUT.
    - Connector part: KF2EDGV-5.08-6P, labeled “Analog Out Patch Panel”.
  * ESD protection is provided on each output using unidirectional TVS diodes (D441–D444, PESD5V0S1UL).
    - Designed for ESD transient suppression to IEC 61000-4-2.
    - Clamping behavior protects against brief high-voltage events.
    - Diodes are placed near the connector to suppress external transients.
  * Ground is shared across DAC, PWM, switching, and analog output stages.
    Proper layout isolation is recommended to minimize cross-domain noise coupling.
  * This design enables software-defined analog output routing:
    - Use DAC for stable analog voltage output.
    - Use PWM or static logic for digital control signals.
    - Outputs are selectable per channel, with seamless runtime switching.
sheet 3
- 500
- Patch Panel
- Selected protection is:
  TWGMC(迪嘉)
  SMBJ30A
  C726833
- ADC
- <<< current flow <<<<
- to ADC
- from second switch
- DRAWING NOTES – SHEET 500 (INPUT PROTECTION AND SWITCH ROUTING)
  * This circuit protects and routes 4 analog input channels from a patch panel through a
  selectable analog conditioning path and into a shared ADC.
  * Signals enter from the patch panel at headers CN-501, -511, -521, and -531.
  * Each signal passes through a 100Ω series resistor to limit inrush and fault current.
  * Schottky diodes (D452–D455, BAT54) clamp each signal to the +5 V rail:
    - Diodes are placed after the 100Ω resistor to safely shunt overvoltage events.
    - Forward voltage is ~0.3 V, providing early clamping around 5.3 V max.
  * Clamped signals continue through labeled nets CIN-SW-501 through CIN-SW-531 to analog switches (TMUX6209).
  * Signals are routed via the selected switch to a signal conditioning circuit:
    - Options include direct voltage, 2:1 divider, 4–20 mA loop, or ground sense.
    - Only one path is active per input channel at a time.
  * After conditioning, signals are routed through a second switch stage and finally into the ADC (ADS1115) for digitization.
  * The 100Ω series resistors:
    - Limit current into the BAT54 clamp during faults.
    - Provide high-frequency damping.
    - Have negligible effect on signal quality at ADC sampling rates.
  * This configuration protects the ADC and muxes from accidental overvoltage, miswiring, or unexpected signal conditions.
  * Clamp strategy assumes inputs remain above GND; reverse protection is not implemented.
  PROGRAMMER NOTES – SHEET 500: ANALOG INPUT SYSTEM
  * The TMUX6209 (U633) is controlled via 3 digital signals: A0, A1, and EN.
    - These are driven by GPIO pins from the I²C GPIO expander (MCP23017, U634).
    - The EN signal should be deasserted (LOW) before changing A0/A1 to avoid glitches or mid-switch artifacts.
    - Wait at least 10 µs after switching before sampling to allow analog settling.
  * Only one signal conditioning path should be active at a time per channel.
    - Valid selections: 00, 01, 10, or 11 (see conditioner map in software).
    - EN must be HIGH to activate the selected signal path.
  * The ADS1115 (U502) is configured over I²C and supports 4 single-ended inputs (AIN0–AIN3).
    - Address is fixed at 0x48.
    - Use single-shot mode unless fast continuous conversion is required.
    - Default full-scale range is ±6.144 V; set to ±4.096 V or lower for best resolution with 0–5 V inputs.
    - Configure MUX bits to select the correct AINx channel.
    - Use 860 SPS for quick response or 128 SPS for higher noise immunity.
  * Current loop inputs (4–20 mA path):
    - Use software scaling: 4 mA = 0 V; 20 mA = V_burden (typically 2 V).
    - Apply calibration factors in firmware to correct for resistor tolerances.
  * Calibration and Filtering:
    - Optional RC filters (~10 kHz cutoff) are present at analog outputs of conditioner paths.
    - Additional digital filtering (e.g. IIR or EMA) is recommended in firmware to reject noise or jitter.
  * Power-On State:
    - Ensure all EN signals are LOW at power-on.
    - Do not leave multiple conditioning paths active simultaneously — this may cause signal contention or distortion.
